# EAGLE design EspLight (EAGLE 7.5.0)
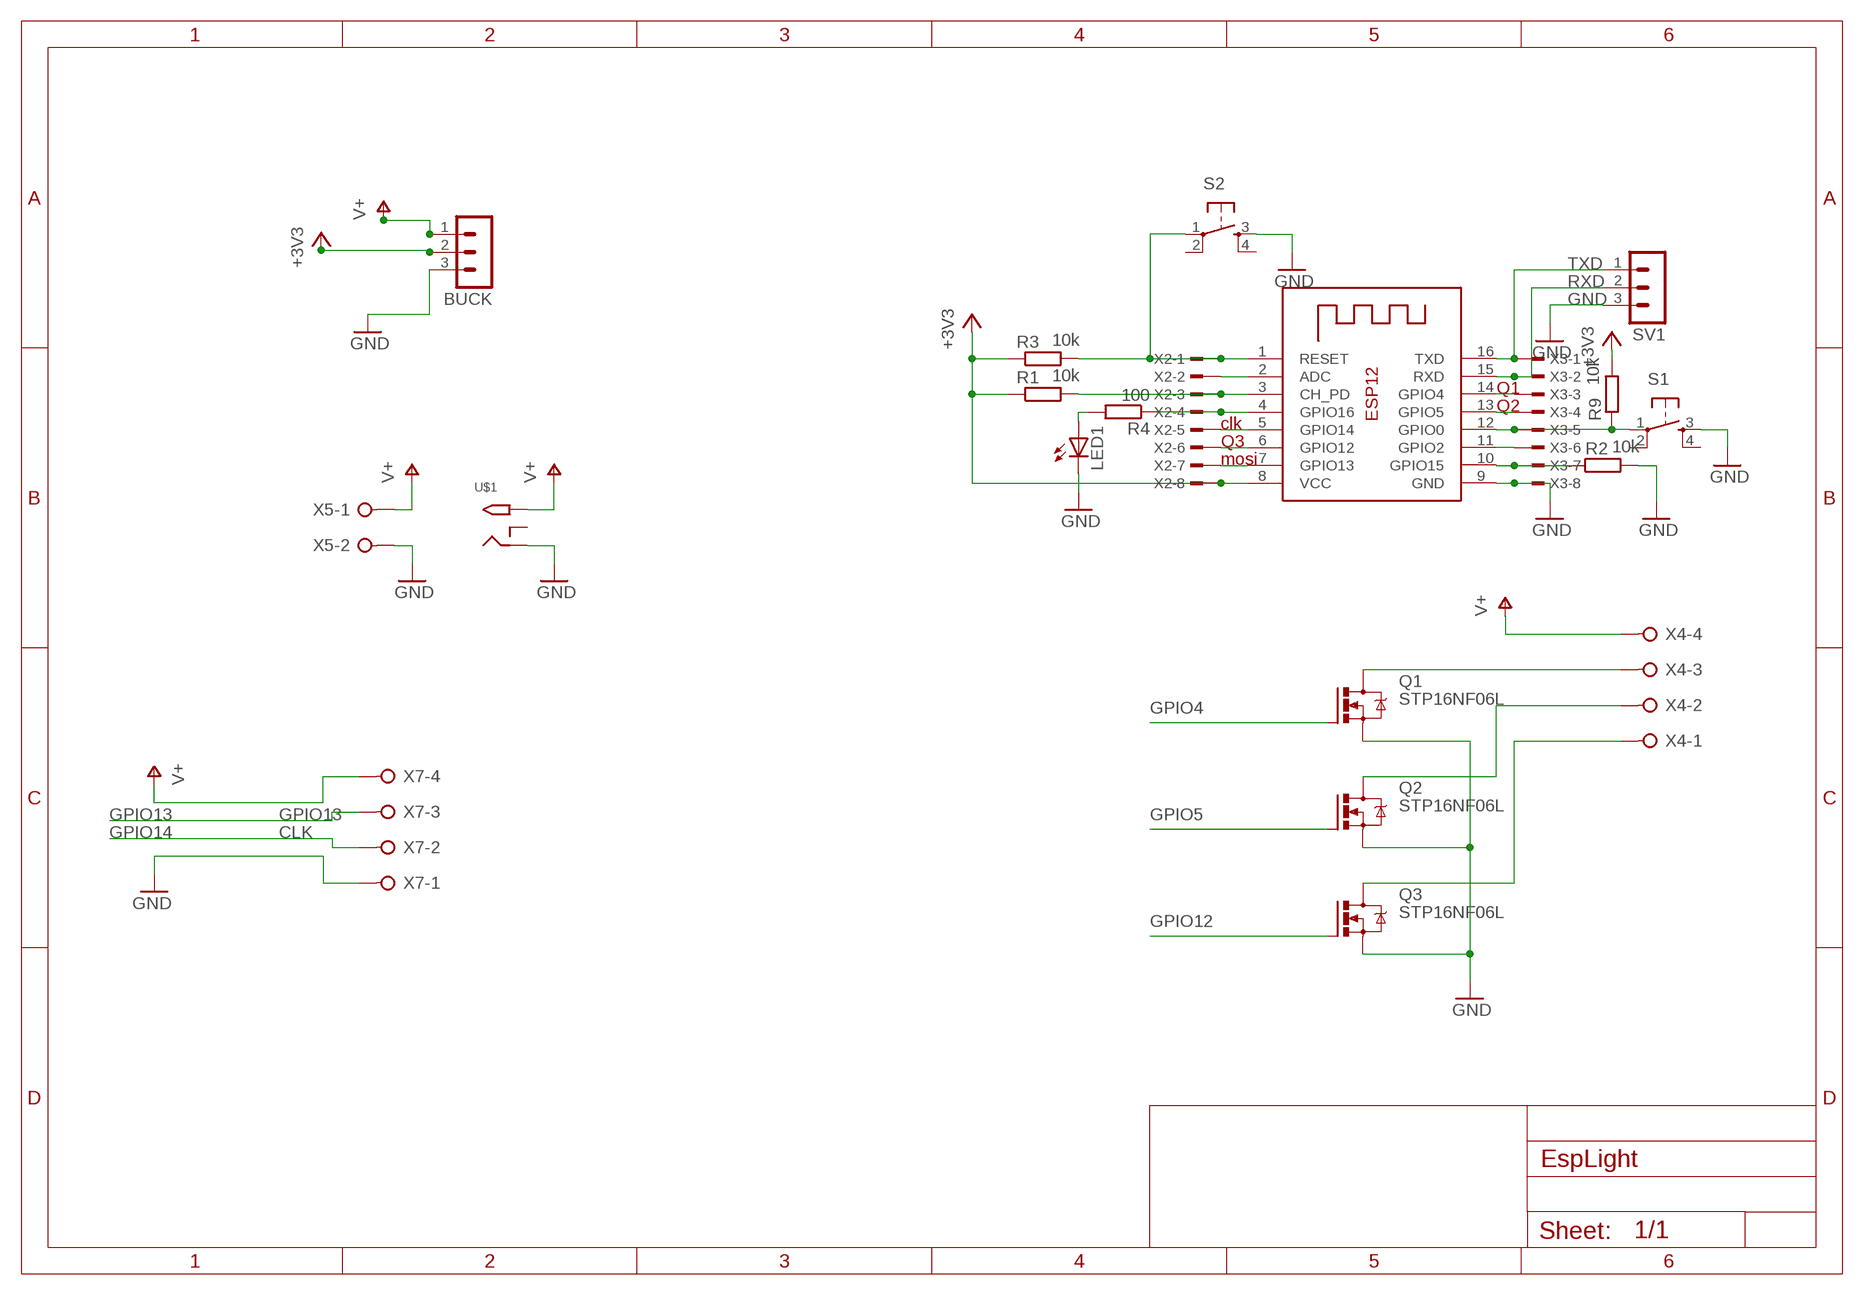
[diagram p0: schematic, sheet 1]

## Parts
BUCK  MA03-1  [MA03-1]
LED1  LED5MM  [LED5MM]
Q1  STP16NF06L  IRF540  [TO220BV]
Q2  STP16NF06L  IRF540  [TO220BV]
Q3  STP16NF06L  IRF540  [TO220BV]
R1  10k  R-EU_0207/10  [0207/10]
R2  10k  R-EU_0207/10  [0207/10]
R3  10k  R-EU_0207/10  [0207/10]
R4  100  R-EU_0207/10  [0207/10]
R9  10k  R-EU_0207/10  [0207/10]
S1  TAC_SWITCHPTH  [TACTILE-PTH]
S2  TAC_SWITCHPTH  [TACTILE-PTH]
SV1  MA03-1  [MA03-1]
U$1  2.1MMJACKTHM  [PJ-102A]
X1  ESP-12  [ESP-12]
X2  TSW-108-02-S-S  [TSW-108-02-S-S]
X3  TSW-108-02-S-S  [TSW-108-02-S-S]
X4  W237-04P  [W237-4P]
X5  W237-02P  [W237-132]
X7  W237-04P  [W237-4P]

## Nets
+3V3: BUCK.2 R1.1 R3.1 R9.2 X1.8(VCC) X2.8
GND: BUCK.3 LED1.K(C) Q1.S Q2.S Q3.S R2.2 S1.3 S2.3 SV1.3 U$1.RING X1.9(GND) X3.8 X5.2 X7.1
GPIO2: X1.11(GPIO2) X3.6
GPIO4: Q1.G X1.14(GPIO4) X3.3
GPIO5: Q2.G X1.13(GPIO5) X3.4
GPIO12: Q3.G X1.6(GPIO12) X2.6
GPIO13: X1.7(GPIO13) X2.7 X7.3
GPIO14: X1.5(GPIO14) X2.5 X7.2
N$2: R3.2 S2.1 X1.1(RESET) X2.1
N$3: R1.2 X1.3(CH_PD) X2.3
N$4: R2.1 X1.10(GPIO15) X3.7
N$6: R4.1 X1.4(GPIO16) X2.4
N$9: R9.1 S1.1 X1.12(GPIO0) X3.5
N$10: X1.2(ADC) X2.2
N$14: LED1.A R4.2
N$18: Q1.D X4.3
N$19: Q2.D X4.2
N$20: Q3.D X4.1
RXD: SV1.2 X1.15(RXD) X3.2
TXD: SV1.1 X1.16(TXD) X3.1
V+: BUCK.1 U$1.TIP X4.4 X5.1 X7.4
Unconnected: S1.2 S1.4 S2.2 S2.4 U$1.RING_SW

## Notes on the sheet
- Q1
- Q2
- clk
- Q3
- mosi
- CLK

## Library data of the parts
BUCK SV1 = con-lstb:MA03-1: PIN HEADER; OC_FARNELL: unknown; OC_NEWARK: unknown
LED1 = adafruit:LED: LED OSRAM: - CHIPLED LG R971, LG N971, LY N971, LG Q971, LY Q971, LO R971, LY R971 LH N974, LH R974 LS Q976, LO Q976, LY Q976 LO Q996 - Hyper CHIPLED LW Q18S LB Q993, LB Q99A, LB R99A - SideLED LS A670, LO A670, LY A670, LG A670, LP A670 LB A673, LV A673, LT A673, LW A673 LH A674 LY A675 LS A676, LA A676, LO A676, LY A676, LW A676 LS A679, LY A679, LG A679 - Hyper Micro SIDELED® LS Y876, LA Y876, LO Y876, LY Y876 LT Y87S - SmartLED LW L88C, LW L88S LB L89C, LB L89S, LG L890 LS L89K, LO L89K, LY L89K LS L896, LA L896, LO L896, LY L896 - TOPLED LS T670, LO T670, LY T670, LG T670, LP T670 LSG T670, LSP T670, LSY T670, LOP T670, LYG T670 LG T671, LOG T671, LSG T671 LB T673, LV T673, LT T673, LW T673 LH T674 LS T676, LA T676, LO T676, LY T676, LB T676, LH T676, LSB T676, LW T676 LB T67C, LV T67C, LT T67C, LS T67K, LO T67K, LY T67K, LW E67C LS E67B, LA E67B, LO E67B, LY E67B, LB E67C, LV E67C, LT E67C LW T67C LS T679, LY T679, LG T679 LS T770, LO T770, LY T770, LG T770, LP T770 LB T773, LV T773, LT T773, LW T773 LH T774 LS E675, LA E675, LY E675, LS T675 LS T776, LA T776, LO T776, LY T776, LB T776 LHGB T686 LT T68C, LB T68C - Hyper Mini TOPLED® LB M676 - Mini TOPLED Santana® LG M470 LS M47K, LO M47K, LY M47K Source: http://www.osram.convergy.de/
Q1-Q3 = transistor-power:IRF540: HEXFET Power MOSFET
R1-R4 R9 = rcl:R-EU_: RESISTOR, European symbol
S1 S2 = SparkFun-Retired:TAC_SWITCH: Momentary Switch Button commonly used for reset or general input. Spark Fun Electronics SKU : COM-00097 SMT- SWCH-08247
U$1 = adafruit:2.1MMJACK: 2.1mm x 5.5mm THM DC jack with internal switch. Digikey part #PJ-102A, 4UCON part #05537 2.1mm x 5.5mm SMT DC jack with internal switch. Digikey part #PJ-002A-SMT, 4UCON part #03267 By microbuilder.eu & adafruit.com
X1 = adafruit:ESP-12
X2 X3 = con-samtec:TSW-108-02-S-S: THROUGH-HOLE .025" SQ POST HEADER Source: Samtec TSW.pdf; OC_FARNELL: unknown; OC_NEWARK: unknown
X4 X7 = con-wago-508:W237-04P: WAGO SREW CLAMP; OC_FARNELL: unknown; OC_NEWARK: unknown
X5 = con-wago-508:W237-02P: WAGO SREW CLAMP; OC_FARNELL: unknown; OC_NEWARK: unknown

## Board
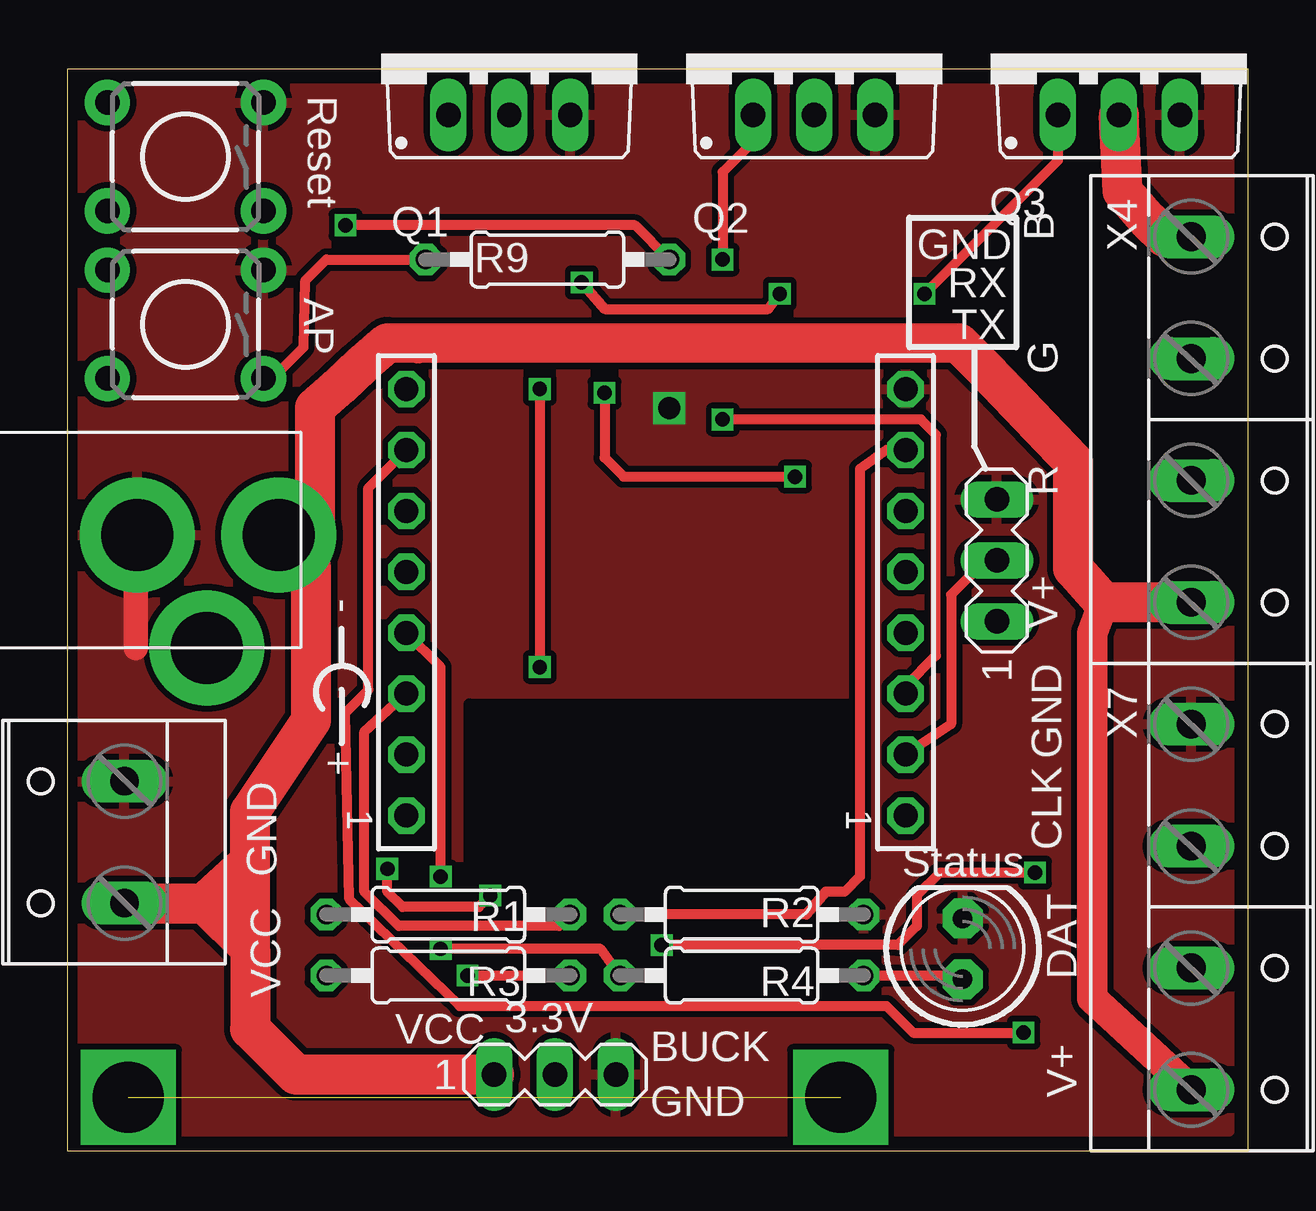
[diagram p1: board, top side]
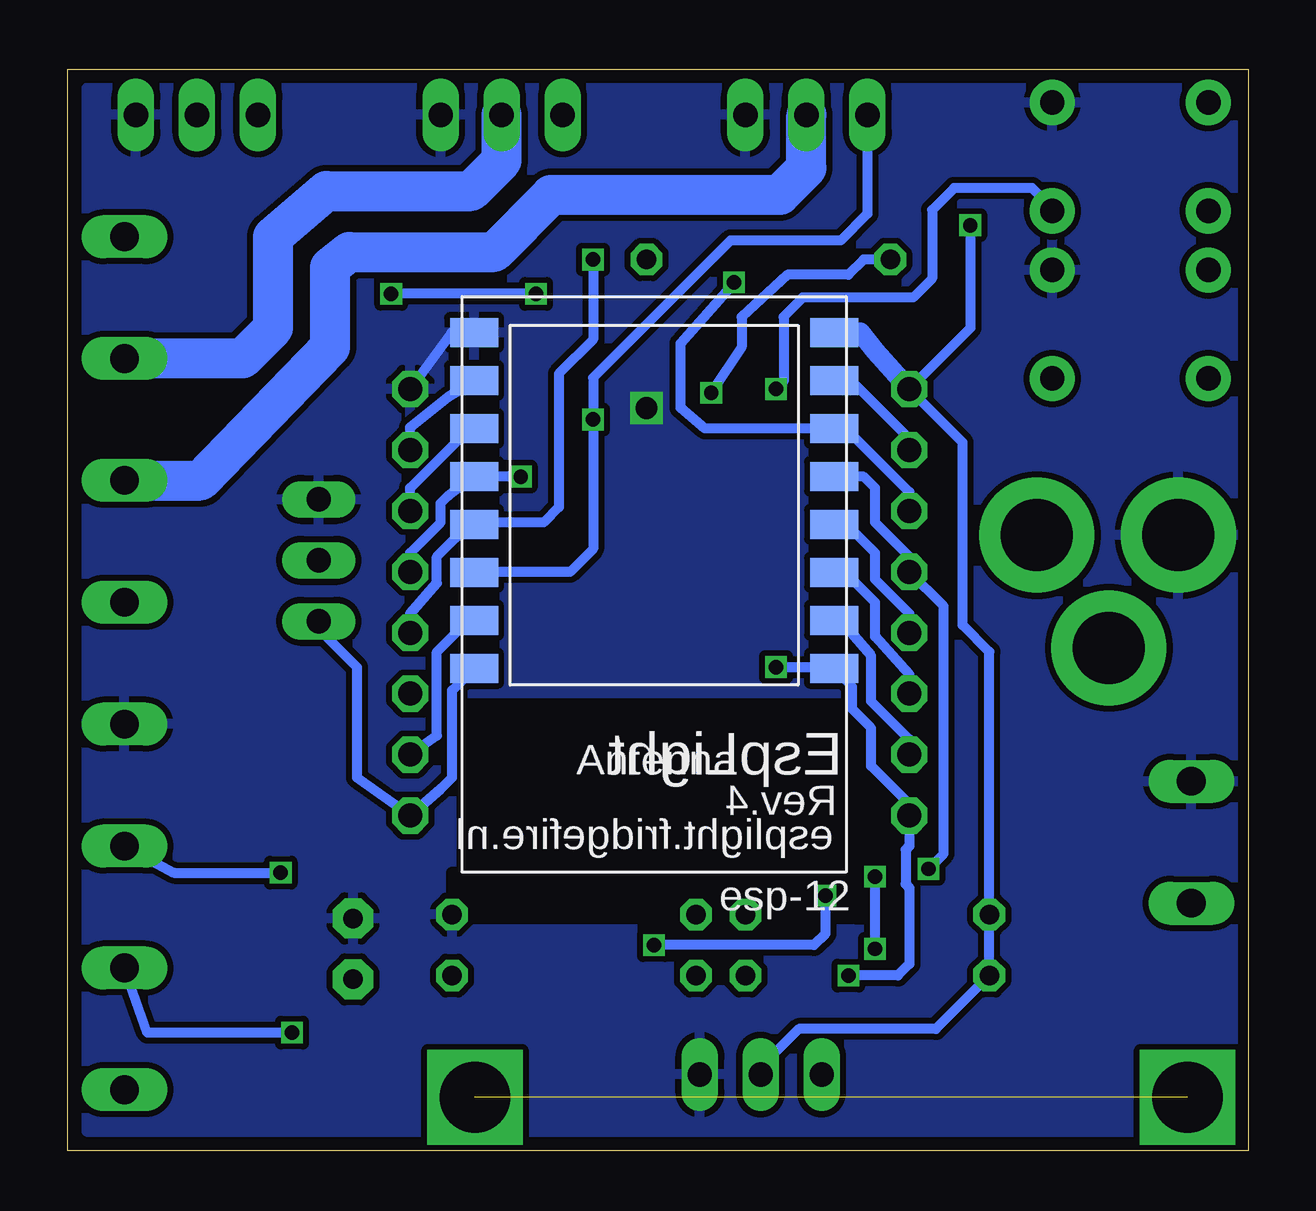
[diagram p2: board, bottom side, seen from below]

Size 49.2 x 45.08 mm. Coordinates in mm from the lower left corner, seen from the top.
Outline: 0,0 49.2,0 49.2,45.08 0,45.08 0,0
Copper layers (1*16): Top 0.035mm / dielectric 1.5mm / Bottom 0.035mm
Design rules "SeeedStudio_2layer_DRU_no_angle_20140221": minimum track width 6mil, minimum drill 12mil, track to track 6mil, track to pad 6mil, pad to pad 6mil, via to via 6mil, smd to smd 0mil, copper to edge 10mil, drill to drill 10mil, minimum pad ring 10mil, minimum via ring 6mil, stop-mask expansion 2mil, vias tented up to drill 100mil, thermal gap 10mil
tRestrict: area 16.4,9.7 to 33.2,11.6
bRestrict: area 16.4,9.7 to 33.2,11.6

### Footprints (pad centres in the part's own frame; a part is rotated, then mirrored left to right if it is on the bottom)
MA03-1 = drill 1.016 long: 1 -2.54,0; 2 0,0; 3 2.54,0
LED5MM = drill 0.813 pad 1.676 octagon: A -1.27,0; K 1.27,0
TO220BV = drill 1.016 long: D 0,-2.54; G -2.54,-2.54; S 2.54,-2.54
0207/10 = drill 0.813 octagon: 1 -5.08,0; 2 5.08,0
TACTILE-PTH = drill 1.016 pad 1.88: 1 -3.251,2.261; 2 3.251,2.261; 3 -3.251,-2.261; 4 3.251,-2.261
PJ-102A = drill 3 pad 4.8: RING 0.1,-3.39; RING_SW -4.6,-6.29; TIP 0.1,-9.29
ESP-12 = smd 2 x 1.2: 1 -7.5,4.5; 2 -7.5,2.5; 3 -7.5,0.5; 4 -7.5,-1.5; 5 -7.5,-3.5; 6 -7.5,-5.5; 7 -7.5,-7.5; 8 -7.5,-9.5; 9 7.5,-9.5; 10 7.5,-7.5; 11 7.5,-5.5; 12 7.5,-3.5; 13 7.5,-1.5; 14 7.5,0.5; 15 7.5,2.5; 16 7.5,4.5
TSW-108-02-S-S = drill 1 pad 1.5 octagon: 1 8.89,0; 2 6.35,0; 3 3.81,0; 4 1.27,0; 5 -1.27,0; 6 -3.81,0; 7 -6.35,0; 8 -8.89,0
W237-4P = drill 1.194 long: 1 -7.62,-0.635; 2 -2.54,-0.635; 3 2.54,-0.635; 4 7.62,-0.635
W237-132 = drill 1.194 long: 1 -2.54,-0.635; 2 2.54,-0.635

### Placement (x,y rotation side)
BUCK  20.32,3.17 0 top
LED1  37.31,8.41 90 top
Q1  18.41,45.72 0 top
Q2  31.11,45.72 0 top
Q3  43.81,45.72 0 top
R1  15.88,9.84 0 top
R2  28.1,9.84 0 top
R3  15.88,7.3 0 top
R4  28.1,7.3 0 top
R9  20,37.15 0 top
S1  4.92,34.45 180 top
S2  4.92,41.43 180 top
SV1  38.73,24.61 90 top
U$1  -0.48,25.56 90 top
X1  24.77,24.61 180 bottom
X2  14.13,22.86 270 top
X3  34.92,22.86 270 top
X4  47.47,30.48 270 top
X5  1.75,12.86 90 top
X7  47.47,10.16 270 top

### Tracks (layer width: path | path; a pad name or v marks a point on that pad's centre or on a via)
+3V3  (via drill 0.6)
  Top 0.406: R9.2 23.65,38.58 v11.59,38.58
  Bottom 0.406: v11.59,38.58 11.59,34.29 X2.8 11.91,29.53 11.91,21.91 10.79,20.8 R1.1 R3.1 13.02,5.08 18.73,5.08 20.32,3.49 BUCK.2
  Bottom 0.813: X2.8 15.56,33.34 16.18,34.13 X1.8
GND  (via drill 0.9)
  Top 1.016: 2.86,26.67 2.86,20.95
  Bottom 0.406: X1.9 33.2,34.11 X3.8
  other vias: 25.08,30.96
  pour Top (isolate 0.254, rank 6): 0.64,44.29 48.42,44.29 48.42,0.79 0.64,0.79
  pour Bottom (isolate 0.254, rank 6): 0.64,44.29 48.42,44.29 48.42,0.79 0.64,0.79
GPIO2
  Bottom 0.406: X3.6 34.92,27.62 33.02,29.53 32.32,30.16 X1.11
GPIO4  (via drill 0.6)
  Top 0.406: X3.3 34.92,19.37 36.2,20.64 36.2,29.84 35.56,30.48 v27.3,30.48
  Bottom 0.406: 32.86,23.97 32.4,23.97 X1.14 32.24,24.13 28.26,24.13 27.3,25.08 v27.3,30.48 27.3,32.23 21.59,37.94 16.99,37.94 15.88,39.05 Q1.G
GPIO5  (via drill 0.6)
  Top 0.406: Q2.G 28.57,42.07 27.3,40.8 v27.3,37.15
  Bottom 0.406: X3.4 34.92,22.38 33.81,23.65 33.81,24.77 33.02,25.56 32.35,26.19 X1.13 32.18,26.19 29.37,26.19 28.73,26.83 28.73,32.38 27.3,33.81 v27.3,37.15
GPIO12  (via drill 0.6)
  Top 0.406: Q3.G 41.27,41.27 v35.72,35.72 | v21.43,36.2 22.38,35.08 29.21,35.08 v29.69,35.72
  Bottom 0.406: X2.6 14.13,27.46 16.67,30 17.16,30 X1.6 22.64,30.11 23.65,30.96 23.65,33.66 v21.43,36.2 | v29.69,35.72 v35.72,35.72 35.88,35.88
GPIO13  (via drill 0.6)
  Top 0.406: X2.7 12.54,27.62 12.54,19.21 11.59,18.26 11.75,10.48 16.35,6.03 34.13,6.03 35.24,4.92 v39.85,4.92
  Bottom 0.406: X2.7 14.13,29.69 16.51,32.07 17.23,32.07 X1.7 | v39.85,4.92 45.88,4.92 X7.3
GPIO14  (via drill 0.6)
  Top 0.406: v17.62,10.64 17.14,10.16 13.97,10.16 13.34,10.79 v13.34,11.75 | v40.32,11.59 36.35,11.59 35.4,10.64 35.4,9.37 34.61,8.57 v24.77,8.57
  Bottom 0.406: X1.5 17.26,28.1 16.03,28.1 15.56,27.62 15.56,26.19 14.13,24.77 X2.5 12.7,22.7 12.7,12.38 v13.34,11.75 | v17.62,10.64 17.62,9.05 18.1,8.57 v24.77,8.57 | X7.2 44.77,11.59 v40.32,11.59
N$2  (via drill 0.6)
  Top 0.406: v16.67,7.3 R3.2 | v19.68,31.75 v19.68,20.16
  Bottom 0.406: v16.67,7.3 14.61,7.3 14.13,7.78 14.13,10.95 14.29,11.11 14.29,12.54 14.13,12.7 X2.1 14.13,14.45 15.72,16.03 15.72,17.62 16.51,18.41 16.51,19.35 X1.1 17.32,20.16 v19.68,20.16 | S2.1 8.57,39.69 9.01,40.13 12.26,40.13 13.18,39.21 13.18,36.35 13.97,35.56 18.57,35.56 19.37,34.77 19.37,32.07 v19.68,31.75
N$3
  Top 0.406: R1.2 20.48,9.37 13.81,9.37 12.38,10.79 12.38,17.46 X2.3
  Bottom 0.406: X2.3 14.13,19.84 15.56,21.43 15.56,22.86 16.67,23.97 17.13,23.97 X1.3
N$4
  Top 0.406: X3.7 34.13,29.21 33.02,28.42 33.02,11.43 32.38,10.79 31.59,10.79 30.8,9.84 R2.1
  Bottom 0.406: X3.7 34.92,30.16 33.34,31.43 32.3,32.07 X1.10
N$6  (via drill 0.6)
  Top 0.406: R4.1 22.23,8.41 v15.56,8.41 | v15.56,11.43 15.56,20.16 X2.4
  Bottom 0.406: X2.4 14.13,22.38 15.56,23.81 15.56,24.92 16.67,26.04 17.19,26.04 X1.4 | v15.56,8.41 v15.56,11.43
N$9  (via drill 0.6)
  Top 0.406: S1.1 8.53,32.19 9.84,33.5 9.92,36.27 10.79,37.15 R9.1 | v22.38,31.59 22.38,28.89 23.18,28.1 v30.32,28.1
  Bottom 0.406: X3.5 34.92,24.92 33.66,26.19 33.66,26.99 33.34,27.3 X1.12 32.26,28.1 v30.32,28.1 | R9.1 16.03,37.15 16.67,36.51 19.21,36.51 21.11,34.77 21.11,33.5 v22.38,31.59
N$10
  Bottom 0.406: X2.2 14.13,17.14 15.72,18.73 15.72,20.64 16.83,21.91 17.07,21.91 X1.2
N$11  (via drill 2.95)  (1 unrouted)
  other vias: 2.54,2.22 32.23,2.22
N$14
  Top 0.406: R4.2 36.99,7.3 LED1.A
N$18
  Bottom 1.676: X4.3 43.66,27.94 38.26,33.5 38.26,36.83 37.47,37.46 31.43,37.46 29.05,39.85 19.53,39.85 18.41,40.96 Q1.D
N$19
  Bottom 1.676: Q2.D 31.11,41.27 32.38,40.01 38.42,40.01 40.64,38.1 40.64,34.29 41.91,33.02 X4.2
N$20
  Top 1.676: X4.1 45.72,38.1 45.09,38.73 43.97,40.01 Q3.D
RXD
  Top 0.406: SV1.2 38.26,24.61 36.83,23.18 36.83,17.78 X3.2
  Bottom 0.406: X3.2 33.81,17.3 33.81,20.8 32.86,21.75 32.62,21.75 X1.15
TXD
  Bottom 0.406: X1.16 33.18,19.19 33.18,15.56 33.66,15.08 X3.1 37.15,15.56 37.15,20.16 38.73,21.75 SV1.1
V+
  Top 0.406: 11.54,32.38 11.38,31.9 | 10.3,27.15 10.32,27.15
  Top 0.61: 14.45,33.96 14.6,33.65
  Top 1.27: 43.18,22.86 42.7,21.59 42.7,6.35 X7.4
  Top 1.676: 7.62,8.41 7.62,12.07 | 7.62,12.07 7.62,14.13 10.16,17.94 10.16,24.31 U$1.TIP 10.3,27.15 | X5.1 5.71,10.32 | 7.62,12.07 5.71,10.32 | 5.71,10.32 7.62,8.41 | X4.4 43.18,22.86 41.91,24.29 41.91,28.73 38.26,32.54 37.15,33.66 14.6,33.65 13.34,33.66 12.22,32.7 11.38,31.9 10.32,30.96 10.32,27.15 10.32,25.56 | 7.62,8.41 7.62,5.08 9.53,3.17 BUCK.1

### Text on the board
tNames: Reset | GND | B | AP | RX | TX | G | R | - | V+ | + | GND | CLK | GND | Status | VCC | DAT | 3.3V | VCC | V+ | GND
bNames: EspLight | Rev.4 | esplight.fridgefire.nl | esp-12